# Altium schematic sheet connectors.SchDoc
size 431 x 279 mm; SheetNumber: 4; SheetTotal: 5
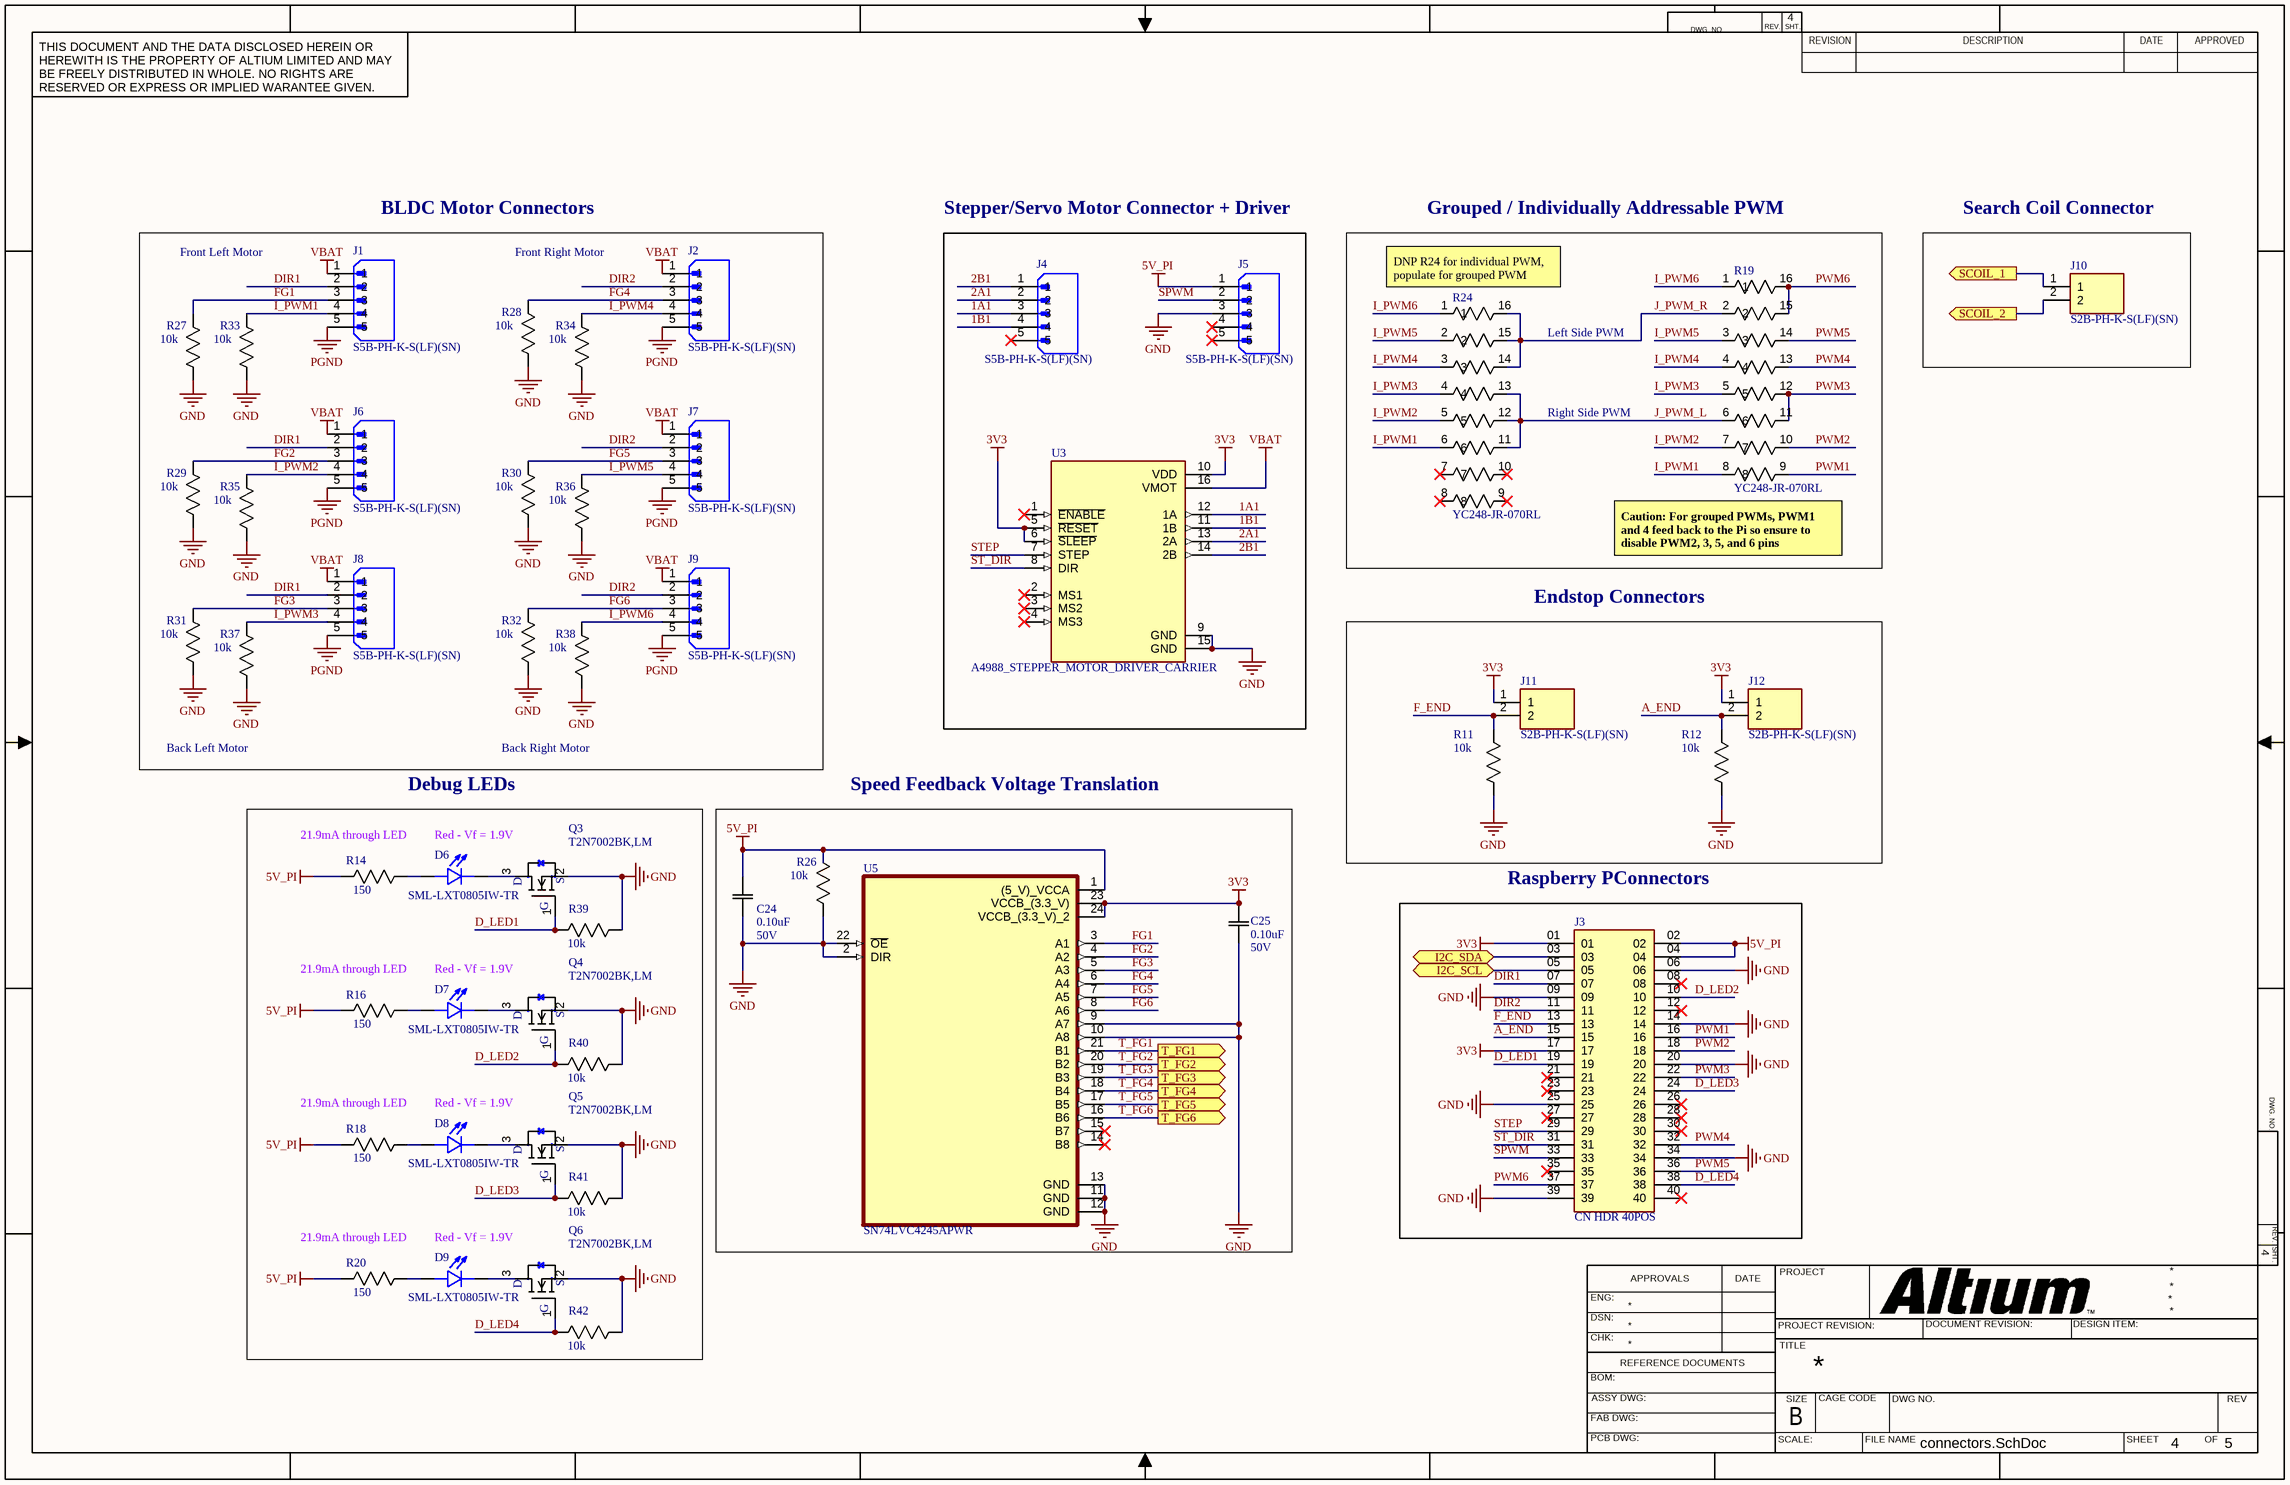
[diagram p0: connectors.SchDoc]

## Parts
C24  Rating: 50V  [0805]  (hidden comment: 0.10uF)
C25  Rating: 50V  [0805]  (hidden comment: 0.10uF)
D6  SML-LXT0805IW-TR  [LEDC2012X120N]
D7  SML-LXT0805IW-TR  [LEDC2012X120N]
D8  SML-LXT0805IW-TR  [LEDC2012X120N]
D9  SML-LXT0805IW-TR  [LEDC2012X120N]
J1  S5B-PH-K-S(LF)(SN)  [JST_S5B-PH-K-S(LF)(SN)]
J2  S5B-PH-K-S(LF)(SN)  [JST_S5B-PH-K-S(LF)(SN)]
J3  CN HDR 40POS  [CN HDR 40POS 0.1 TH]
J4  S5B-PH-K-S(LF)(SN)  [JST_S5B-PH-K-S(LF)(SN)]
J5  S5B-PH-K-S(LF)(SN)  [JST_S5B-PH-K-S(LF)(SN)]
J6  S5B-PH-K-S(LF)(SN)  [JST_S5B-PH-K-S(LF)(SN)]
J7  S5B-PH-K-S(LF)(SN)  [JST_S5B-PH-K-S(LF)(SN)]
J8  S5B-PH-K-S(LF)(SN)  [JST_S5B-PH-K-S(LF)(SN)]
J9  S5B-PH-K-S(LF)(SN)  [JST_S5B-PH-K-S(LF)(SN)]
J10  S2B-PH-K-S(LF)(SN)  [JST_S2B-PH-K-S(LF)(SN)]
J11  S2B-PH-K-S(LF)(SN)  [JST_S2B-PH-K-S(LF)(SN)]
J12  S2B-PH-K-S(LF)(SN)  [JST_S2B-PH-K-S(LF)(SN)]
Q3  T2N7002BK,LM  [SOT23_TOS]
Q4  T2N7002BK,LM  [SOT23_TOS]
Q5  T2N7002BK,LM  [SOT23_TOS]
Q6  T2N7002BK,LM  [SOT23_TOS]
R11  10k  [0805]
R12  10k  [0805]
R14  150  [0805]
R16  150  [0805]
R18  150  [0805]
R19  YC248-JR-070RL  [RES_YC248_4X1P6_YAG-M]
R20  150  [0805]
R24  YC248-JR-070RL  [RES_YC248_4X1P6_YAG-M]
R26  10k  [0805]
R27  10k  [0805]
R28  10k  [0805]
R29  10k  [0805]
R30  10k  [0805]
R31  10k  [0805]
R32  10k  [0805]
R33  10k  [0805]
R34  10k  [0805]
R35  10k  [0805]
R36  10k  [0805]
R37  10k  [0805]
R38  10k  [0805]
R39  10k  [0805]
R40  10k  [0805]
R41  10k  [0805]
R42  10k  [0805]
U3  A4988_STEPPER_MOTOR_DRIVER_CARRIER  [MODULE_A4988_STEPPER_MOTOR_DRIVER_CARRIER]
U5  SN74LVC4245APWR  [SOP65P640X120-24N]

## Blocks framed on the sheet
BLDC Motor Connectors: J1 J2 J6-J9 R27-R38
Stepper/Servo Motor Connector + Driver: J4 J5 U3
Grouped / Individually Addressable PWM: R19 R24
Search Coil Connector: J10
Endstop Connectors: J11 J12 R11 R12
Debug LEDs: D6-D9 Q3-Q6 R14 R16 R18 R20 R39-R42
Speed Feedback Voltage Translation: C24 C25 R26 U5
Raspberry PConnectors: J3

## Ports
I2C_SCL (bidir), I2C_SDA (bidir), SCOIL_1 (out), SCOIL_2 (out), T_FG1 (out), T_FG2 (out), T_FG3 (out), T_FG4 (out), T_FG5 (out), T_FG6 (out)

## Nets
3V3: C25.2(C2) J3.01 J3.17 J11.1 J12.1 U3.5(~{RESET}) U3.6(~{SLEEP}) U3.10(VDD) U5.23(VCCB_(3.3_V)) U5.24(VCCB_(3.3_V)_2)
5V_PI: C24.2(C2) J3.02 J3.04 J5.1 R14.2(R2) R16.2(R2) R18.2(R2) R20.2(R2) R26.1(R1) U5.1((5_V)_VCCA)
GND: C24.1(C1) C25.1(C1) J3.06 J3.09 J3.14 J3.20 J3.25 J3.34 J3.39 J5.3 Q3.2(S) Q4.2(S) Q5.2(S) Q6.2(S) R11.1(R1) R12.1(R1) R26.2(R2) R27.2(R2) R28.2(R2) R29.2(R2) R30.2(R2) R31.2(R2) R32.2(R2) R33.2(R2) R34.2(R2) R35.2(R2) R36.2(R2) R37.2(R2) R38.2(R2) R39.1(R1) R40.1(R1) R41.1(R1) R42.1(R1) U3.9(GND) U3.15(GND) U5.2(DIR) U5.9(A7) U5.10(A8) U5.11(GND) U5.12(GND) U5.13(GND) U5.22(~{OE})
PGND: J1.5 J2.5 J6.5 J7.5 J8.5 J9.5
VBAT: J1.1 J2.1 J6.1 J7.1 J8.1 J9.1 U3.16(VMOT)
1A1: J4.3 U3.12(1A)
1B1: J4.4 U3.11(1B)
2A1: J4.2 U3.13(2A)
2B1: J4.1 U3.14(2B)
A_END: J3.15 J12.2 R12.2(R2)
D_LED1: J3.19 Q3.1(G) R39.2(R2)
D_LED2: J3.10 Q4.1(G) R40.2(R2)
D_LED3: J3.24 Q5.1(G) R41.2(R2)
D_LED4: J3.38 Q6.1(G) R42.2(R2)
DIR1: J1.2 J3.07 J6.2 J8.2
DIR2: J2.2 J3.11 J7.2 J9.2
F_END: J3.13 J11.2 R11.2(R2)
FG1: J1.3 R27.1(R1) U5.3(A1)
FG2: J6.3 R29.1(R1) U5.4(A2)
FG3: J8.3 R31.1(R1) U5.5(A3)
FG4: J2.3 R28.1(R1) U5.6(A4)
FG5: J7.3 R30.1(R1) U5.7(A5)
FG6: J9.3 R32.1(R1) U5.8(A6)
I2C_SCL: J3.05 ; port I2C_SCL
I2C_SDA: J3.03 ; port I2C_SDA
I_PWM1: J1.4 R19.8 R24.6 R33.1(R1)
I_PWM2: J6.4 R19.7 R24.5 R35.1(R1)
I_PWM3: J8.4 R19.5 R24.4 R37.1(R1)
I_PWM4: J2.4 R19.4 R24.3 R34.1(R1)
I_PWM5: J7.4 R19.3 R24.2 R36.1(R1)
I_PWM6: J9.4 R19.1 R24.1 R38.1(R1)
J_PWM_L: R19.6 R24.11 R24.12 R24.13
J_PWM_R: R19.2 R24.14 R24.15 R24.16
PWM1: J3.16 R19.9
PWM2: J3.18 R19.10
PWM3: J3.22 R19.11 R19.12
PWM4: J3.32 R19.13
PWM5: J3.36 R19.14
PWM6: J3.37 R19.15 R19.16
SCOIL_1: J10.1 ; port SCOIL_1
SCOIL_2: J10.2 ; port SCOIL_2
SPWM: J3.33 J5.2
ST_DIR: J3.31 U3.8(DIR)
STEP: J3.29 U3.7(STEP)
T_FG1: U5.21(B1) ; port T_FG1
T_FG2: U5.20(B2) ; port T_FG2
T_FG3: U5.19(B3) ; port T_FG3
T_FG4: U5.18(B4) ; port T_FG4
T_FG5: U5.17(B5) ; port T_FG5
T_FG6: U5.16(B6) ; port T_FG6
NetD6_A: D6.A R14.1(R1)
NetD6_C: D6.C Q3.3(D)
NetD7_A: D7.A R16.1(R1)
NetD7_C: D7.C Q4.3(D)
NetD8_A: D8.A R18.1(R1)
NetD8_C: D8.C Q5.3(D)
NetD9_A: D9.A R20.1(R1)
NetD9_C: D9.C Q6.3(D)

Not connected (* = marked no-connect by the designer): J3 08* 12* 21* 23* 26* 27* 28* 30* 35* 40*; J4 5*; J5 4* 5*; R24 7* 8* 9* 10*; U3 1(~{ENABLE})* 2(MS1)* 3(MS2)* 4(MS3)*; U5 14(B8)* 15(B7)*

## Notes on the sheet
- Front Left Motor
- Front Right Motor
- (near R24) DNP R24 for individual PWM, populate for grouped PWM
- Left Side PWM
- Right Side PWM
- (near R19) Caution: For grouped PWMs, PWM1 and 4 feed back to the Pi so ensure to disable PWM2, 3, 5, and 6 pins
- Back Left Motor
- Back Right Motor
- 21.9mA through LED
- Red - Vf = 1.9V
- DWG. NO.
- REV.
- SHT.
- THIS DOCUMENT AND THE DATA DISCLOSED HEREIN OR HEREWITH IS THE PROPERTY OF ALTIUM LIMITED AND MAY BE FREELY DISTRIBUTED IN WHOLE. NO RIGHTS ARE RESERVED OR EXPRESS OR IMPLIED WARANTEE GIVEN.
- REVISION
- DESCRIPTION
- DATE
- APPROVED
- ENG:
- APPROVALS
- PROJECT
- DSN:
- CHK:
- REFERENCE DOCUMENTS
- PROJECT REVISION:
- TITLE
- DOCUMENT REVISION:
- DESIGN ITEM:
- BOM:
- FAB DWG:
- PCB DWG:
- ASSY DWG:
- SCALE:
- SIZE
- B
- CAGE CODE
- FILE NAME
- DWG NO.
- SHEET
- OF
- REV

## Library data of the parts
C24 C25 = CAP 0.1uF 50V: Default Symbol for Capacitors; Temperature Coefficient: X7R; Tolerance: 10%; Value: 0.10uF; Part Number: CAP 0.1uF 50V
D6-D9 = SML-LXT0805IW-TR: LED;Red;11mcd;0.061In.Dia.;SMD;100mA;2V Vf;635nm;140deg;SMD;White Diffused;5V Vr | Lumex SML-LXT0805IW-TR; MF: Lumex Opto/Components; SnapEDA_Link: https://www.snapeda.com/parts/SML-LXT0805IW-TR/Lumex+Opto%252FComponents+Inc./view-part/?ref=snap; Package: 0805 Lumex; Value: *; MP: SML-LXT0805IW-TR; Check_prices: https://www.snapeda.com/parts/SML-LXT0805IW-TR/Lumex+Opto%252FComponents+Inc./view-part/?ref=eda
J1 J2 J4-J9 = S5B-PH-K-S(LF)(SN): Connector Header Through Hole, Right Angle 5 position 0.079 (2.00mm); MF: JST Sales America Inc.; Package: NON STANDARD-5 J.S.T.; Price: None; Check_prices: https://www.snapeda.com/parts/S5B-PH-K-S(LF)(SN)/JST+Sales+America+Inc./view-part/?ref=eda; Value: *; SnapEDA_Link: https://www.snapeda.com/parts/S5B-PH-K-S(LF)(SN)/JST+Sales+America+Inc./view-part/?ref=snap; MP: S5B-PH-K-S(LF)(SN); Availability: In Stock; Purchase-URL: https://pricing.snapeda.com/search/part/S5B-PH-K-S(LF)(SN)/?ref=eda
J3 = CN HDR 40POS: 40 Position Header Connector; Part Number: CN HDR 40POS; Supplier 1: Digi-Key; Supplier Part Number 1: S6104-ND; Supplier URL 1: https://www.digikey.ca/en/products/detail/sullins-connector-solutions/PPTC202LFBN-RC/807240?s=N4IgTCBcDaIMoDYCMAGALAWgHIBEQF0BfIA; Pin Count: 40
J10-J12 = S2B-PH-K-S(LF)(SN): Connector Header Through Hole, Right Angle 2 position; MF: JST Sales America Inc.; Price: None; Availability: In Stock; Package: None; MP: S2B-PH-K-S(LF)(SN); Value: *; SnapEDA_Link: https://www.snapeda.com/parts/S2B-PH-K-S(LF)(SN)/JST+Sales+America+Inc./view-part/?ref=snap; Purchase-URL: https://pricing.snapeda.com/search/part/S2B-PH-K-S(LF)(SN)/?ref=eda; Check_prices: https://www.snapeda.com/parts/S2B-PH-K-S(LF)(SN)/JST+Sales+America+Inc./view-part/?ref=eda
Q3-Q6 = T2N7002BK,LM: No Description Available; Mfr_Name: Toshiba Electronic Devices & Storage Corp.; RefDes: RefDes; Type: Type
R11 R12 = RES 10k 1/8W - 1%: RES SMD 10K OHM 1% 1/8W 0603; Manufacturer Part Number 1: ERJ-H3GJ103V; Power (Watts): 0.125W; Tolerance: 5%; Package: 0805; Value: 10k; Part Number: RES 10k 1/8W - 1%; Supplier 1: Digi-Key; Supplier Part Number 1: 10-ERJ-H3GJ103VCT-ND; Supplier URL 1: https://www.digikey.ca/en/products/detail/panasonic-electronic-components/ERJ-H3GJ103V/13877876?s=N4IgTCBcDaIIwAYC0BRASgKSQCQMwHENFcA1AYQBUkA5AERAF0BfIA; Manufacturer Part Number 2: RMCF0805JT10K0; Supplier 2: Digi-Key; Supplier Part Number 2: RMCF0805JT10K0CT-ND; Supplier URL 2: https://www.digikey.ca/en/products/detail/stackpole-electronics-inc/RMCF0805JT10K0/1757762?s=N4IgTCBcDaIEoFkDCAxADADjQVgFIBUBGNAaTSXxAF0BfIA; Tolerance 2: 5%
R14 R16 R18 R20 = RES 150.0 1/8W: Default Resistor Symbol; Power (Watts): 0.125W; Tolerance: 5%; Package: 0805; Value: 150; Part Number: RES 150.0 1/8W
R19 R24 = YC248-JR-070RL: No Description Available; Mfr_Name: Yageo
R26-R42 = RES 10k 1/8W - 1%: Default Resistor Symbol; Manufacturer Part Number 1: ERJ-H3GJ103V; Power (Watts): 0.125W; Tolerance: 5%; Package: 0805; Value: 10k; Part Number: RES 10k 1/8W - 1%; Supplier 1: Digi-Key; Supplier Part Number 1: 10-ERJ-H3GJ103VCT-ND; Supplier URL 1: https://www.digikey.ca/en/products/detail/panasonic-electronic-components/ERJ-H3GJ103V/13877876?s=N4IgTCBcDaIIwAYC0BRASgKSQCQMwHENFcA1AYQBUkA5AERAF0BfIA; Manufacturer Part Number 2: RMCF0805JT10K0; Supplier 2: Digi-Key; Supplier Part Number 2: RMCF0805JT10K0CT-ND; Supplier URL 2: https://www.digikey.ca/en/products/detail/stackpole-electronics-inc/RMCF0805JT10K0/1757762?s=N4IgTCBcDaIEoFkDCAxADADjQVgFIBUBGNAaTSXxAF0BfIA; Tolerance 2: 5%
U3 = A4988_STEPPER_MOTOR_DRIVER_CARRIER: Stepper motor controler; IC: A4988; 1A; Uin mot: 8Ã·35V; Price: None; Value: *; MP: A4988_STEPPER_MOTOR_DRIVER_CARRIER; Package: None; Availability: Unavailable
U5 = SN74LVC4245APWR: 24-TSSOP -40 ~ 85; MF: Texas Instruments; MP: SN74LVC4245APWR; DigiKey-Purchase-URL: https://snapeda.com/shop?store=DigiKey&id=235354; Package: TSSOP-24 Texas Instruments; Availability: Good; Price: None; Mouser-Purchase-URL: https://snapeda.com/shop?store=Mouser&id=235354; Texas_Instruments-Purchase-URL: https://snapeda.com/shop?store=Texas+Instruments&id=235354; SnapEDA_Link: https://www.snapeda.com/parts/SN74LVC4245APWR/Texas%20Instruments/view-part/235354/?ref=snap; Value: *; BuyPart: https://www.snapeda.com/parts/SN74LVC4245APWR/Texas%20Instruments/view-part/235354/?ref=eda